# Altium schematic sheet Precharge_schematic.SchDoc
size A4
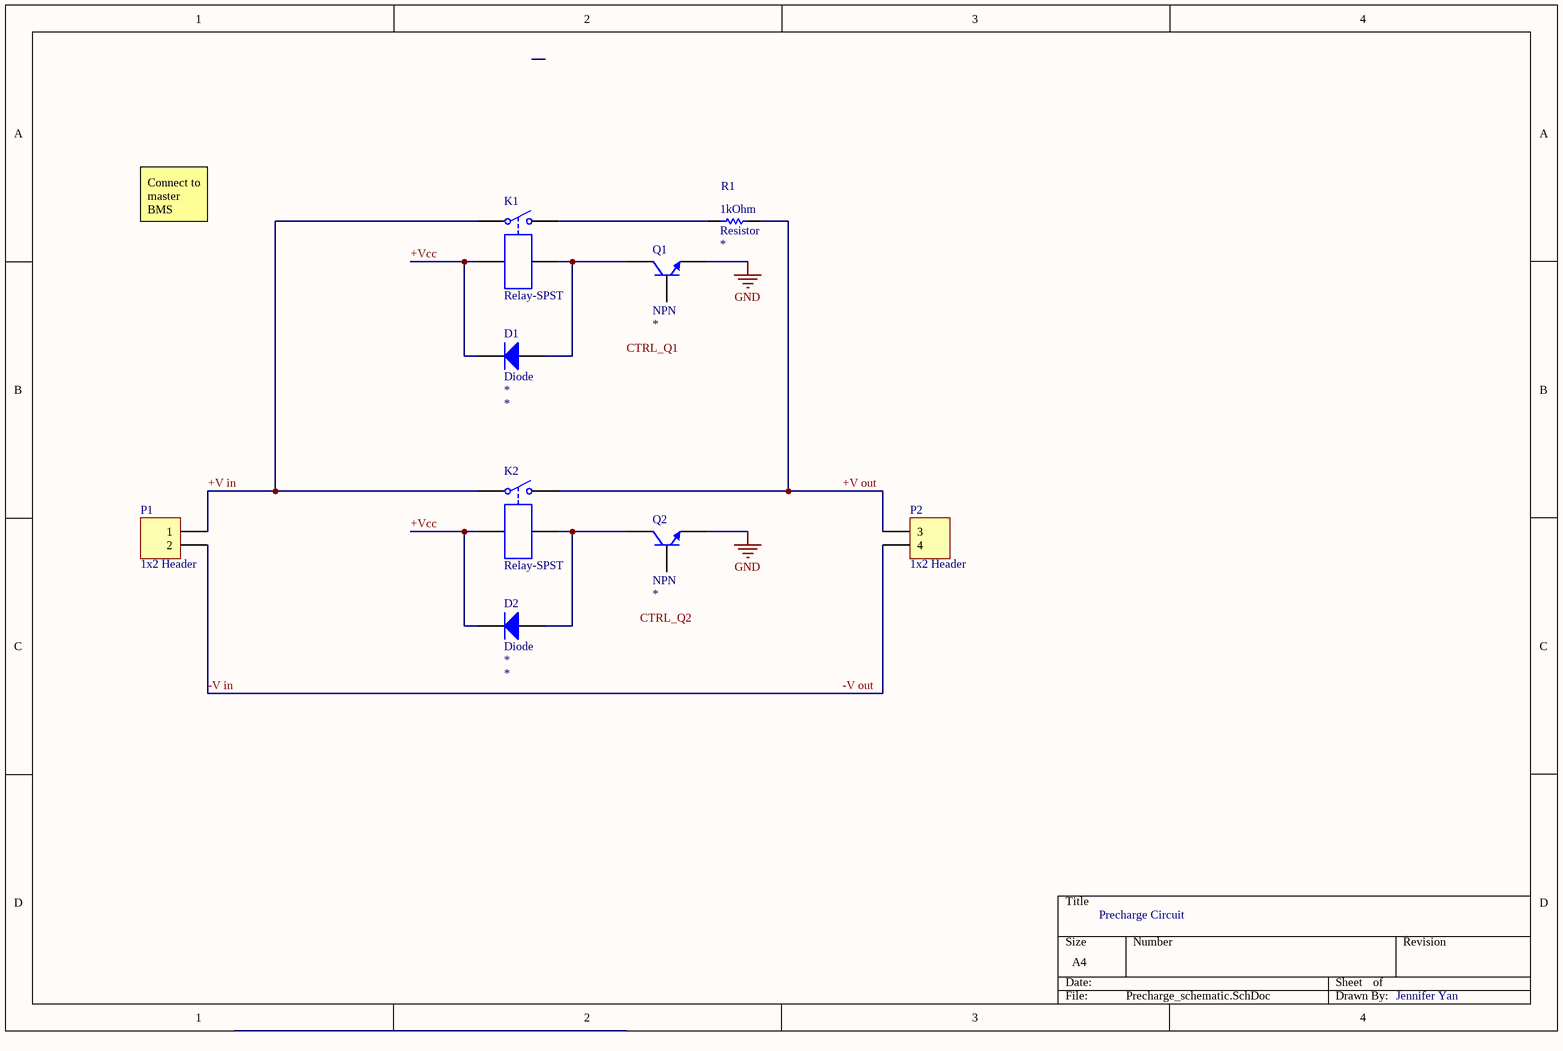
[diagram p0: Precharge_schematic.SchDoc]

## Parts
1kOhm  Resistor  [0603 - Resistor]
D1  Diode
D2  Diode
K1  Relay-SPST  [MODULE4]
K2  Relay-SPST  [MODULE4]
P1  1x2 Header
P2  1x2 Header
Q1  NPN
Q2  NPN

## Nets
GND: Q1.3(E) Q2.3(E)
+V in: K1.1 K2.1 P1.1
+V out: 1kOhm.2 K2.2 P2.3
+Vcc: D1.2(K) D2.2(K) K1.3 K2.3
-V in: P1.2 P2.4  [also labelled -V out]
Net1kOhm_1: 1kOhm.1 K1.2
NetD1_1: D1.1(A) K1.4 Q1.1(C)
NetD2_1: D2.1(A) K2.4 Q2.1(C)

Not connected (* = marked no-connect by the designer): Q1 2(B); Q2 2(B)

## Notes on the sheet
- Connect to master BMS GPIO
- (near 1kOhm) R1
- Precharge Circuit
- Jennifer Yan
- Labels drawn without touching a wire or pin: CTRL_Q1, CTRL_Q2

## Library data of the parts
K1 K2 = Relay-SPST: Single-Pole Single-Throw Relay; Published: 24-Mar-1999; LatestRevisionDate: 17-Jul-2002; LatestRevisionNote: Re-released for DXP Platform.; PackageReference: MODULE4; Publisher: Altium Limited
P1 P2 = 1x2 Header: 1x2 Pin Header
Q1 Q2 = NPN: NPN Bipolar Transistor; Rating: *; Manufacturer: *; Manufacturer Part Number: *; Supplier: *; Supplier Part Number: *; Value: *
1kOhm = Resistor: Rating: *; Manufacturer Part Number: *; Manufacturer: *; Supplier Part Number: *; Supplier: *; Value: *
D1 D2 = Diode: Rating: *; Supplier Part Number: *; Manufacturer: *; Supplier: *; Value: *; Manufacturer Part Number: *